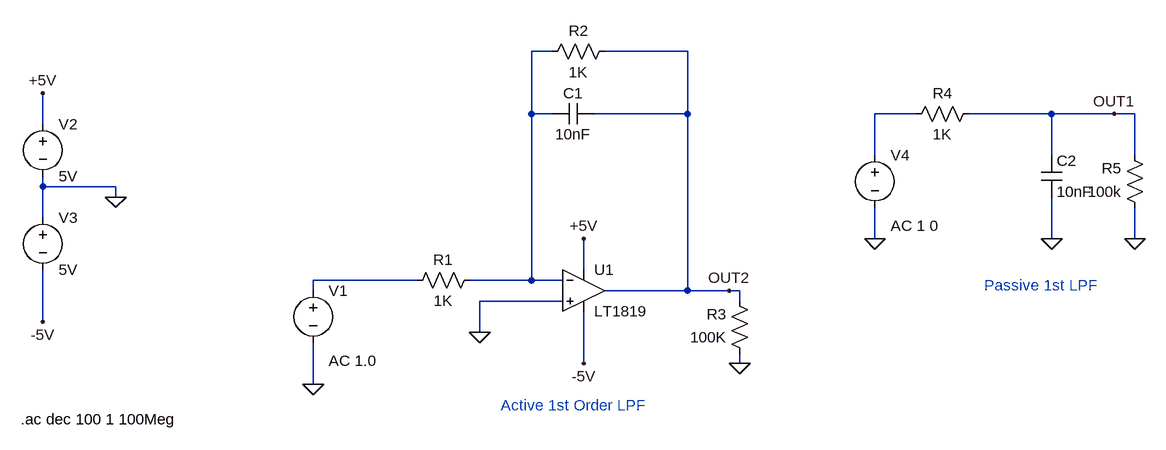
[diagram p0: schematic FirstOrderFilter.asc]
FirstOrderFilter.asc, the LTspice schematic file:
Version 4
SHEET 1 880 680
WIRE -352 -96 -384 -96
WIRE -144 -96 -272 -96
WIRE -384 0 -384 -96
WIRE -352 0 -384 0
WIRE -144 0 -144 -96
WIRE -144 0 -288 0
WIRE 208 0 144 0
WIRE 416 0 288 0
WIRE 512 0 416 0
WIRE 544 0 512 0
WIRE -1136 16 -1136 -32
WIRE 144 64 144 0
WIRE 416 64 416 0
WIRE 544 64 544 0
WIRE -1136 112 -1136 96
WIRE -1024 112 -1136 112
WIRE -1024 128 -1024 112
WIRE -1136 160 -1136 112
WIRE 144 192 144 144
WIRE 416 192 416 128
WIRE 544 192 544 144
WIRE -304 240 -304 192
WIRE -560 256 -720 256
WIRE -384 256 -384 0
WIRE -384 256 -480 256
WIRE -336 256 -384 256
WIRE -720 272 -720 256
WIRE -144 272 -144 0
WIRE -144 272 -272 272
WIRE -80 272 -144 272
WIRE -64 272 -80 272
WIRE -336 288 -464 288
WIRE -64 288 -64 272
WIRE -1136 320 -1136 240
WIRE -464 336 -464 288
WIRE -304 384 -304 304
WIRE -64 384 -64 368
WIRE -720 416 -720 352
FLAG -720 416 0
FLAG -464 336 0
FLAG -64 384 0
FLAG -1024 128 0
FLAG -304 192 +5V
FLAG -304 384 -5V
FLAG -1136 -32 +5V
FLAG -1136 320 -5V
FLAG -80 272 OUT2
FLAG 144 192 0
FLAG 416 192 0
FLAG 544 192 0
FLAG 512 0 OUT1
SYMBOL res -464 240 R90
WINDOW 0 0 56 VBottom 2
WINDOW 3 32 56 VTop 2
SYMATTR InstName R1
SYMATTR Value 1K
SYMBOL voltage -720 256 R0
WINDOW 123 24 124 Left 2
WINDOW 39 0 0 Left 2
SYMATTR InstName V1
SYMATTR Value ""
SYMATTR Value2 AC 1.0
SYMBOL res -256 -112 R90
WINDOW 0 0 56 VBottom 2
WINDOW 3 32 56 VTop 2
SYMATTR InstName R2
SYMATTR Value 1K
SYMBOL res -48 384 R180
WINDOW 0 36 76 Left 2
WINDOW 3 36 40 Left 2
SYMATTR InstName R3
SYMATTR Value 100K
SYMBOL cap -288 -16 R90
WINDOW 0 0 32 VBottom 2
WINDOW 3 32 32 VTop 2
SYMATTR InstName C1
SYMATTR Value 10nF
SYMBOL Opamps\\LT1819 -304 272 R0
SYMATTR InstName U1
SYMBOL voltage -1136 0 R0
WINDOW 123 0 0 Left 2
WINDOW 39 0 0 Left 2
SYMATTR InstName V2
SYMATTR Value 5V
SYMBOL voltage -1136 144 R0
WINDOW 123 0 0 Left 2
WINDOW 39 0 0 Left 2
SYMATTR InstName V3
SYMATTR Value 5V
SYMBOL res 304 -16 R90
WINDOW 0 0 56 VBottom 2
WINDOW 3 32 56 VTop 2
SYMATTR InstName R4
SYMATTR Value 1K
SYMBOL res 560 160 R180
WINDOW 0 36 76 Left 2
WINDOW 3 36 40 Left 2
SYMATTR InstName R5
SYMATTR Value 100k
SYMBOL cap 400 64 R0
SYMATTR InstName C2
SYMATTR Value 10nF
SYMBOL voltage 144 48 R0
WINDOW 123 24 124 Left 2
WINDOW 39 0 0 Left 2
SYMATTR InstName V4
SYMATTR Value ""
SYMATTR Value2 AC 1 0
TEXT -432 448 Left 2 ;Active 1st Order LPF
TEXT 312 264 Left 2 ;Passive 1st LPF
TEXT -1170 470 Left 2 !.ac dec 100 1 100Meg

The netlist it stands for:
* FirstOrderFilter.asc
R1 N001 N003 1K
V1 N003 0 AC 1.0
R2 OUT2 N001 1K
R3 0 OUT2 100K
C1 OUT2 N001 10nF
* U1: LT1819 (symbol Opamps\LT1819 not available, pins judged from their places): In+=0 In-=N001 V+=+5V V-=-5V OUT=OUT2
V2 +5V 0 5V
V3 0 -5V 5V
R4 OUT1 N002 1K
R5 0 OUT1 100k
C2 OUT1 0 10nF
V4 N002 0 AC 1 0
* Active 1st Order LPF
* Passive 1st LPF
.ac dec 100 1 100Meg
.backanno
.end